# EAGLE schematic HE6-RORO101 (EAGLE 9.6.2)
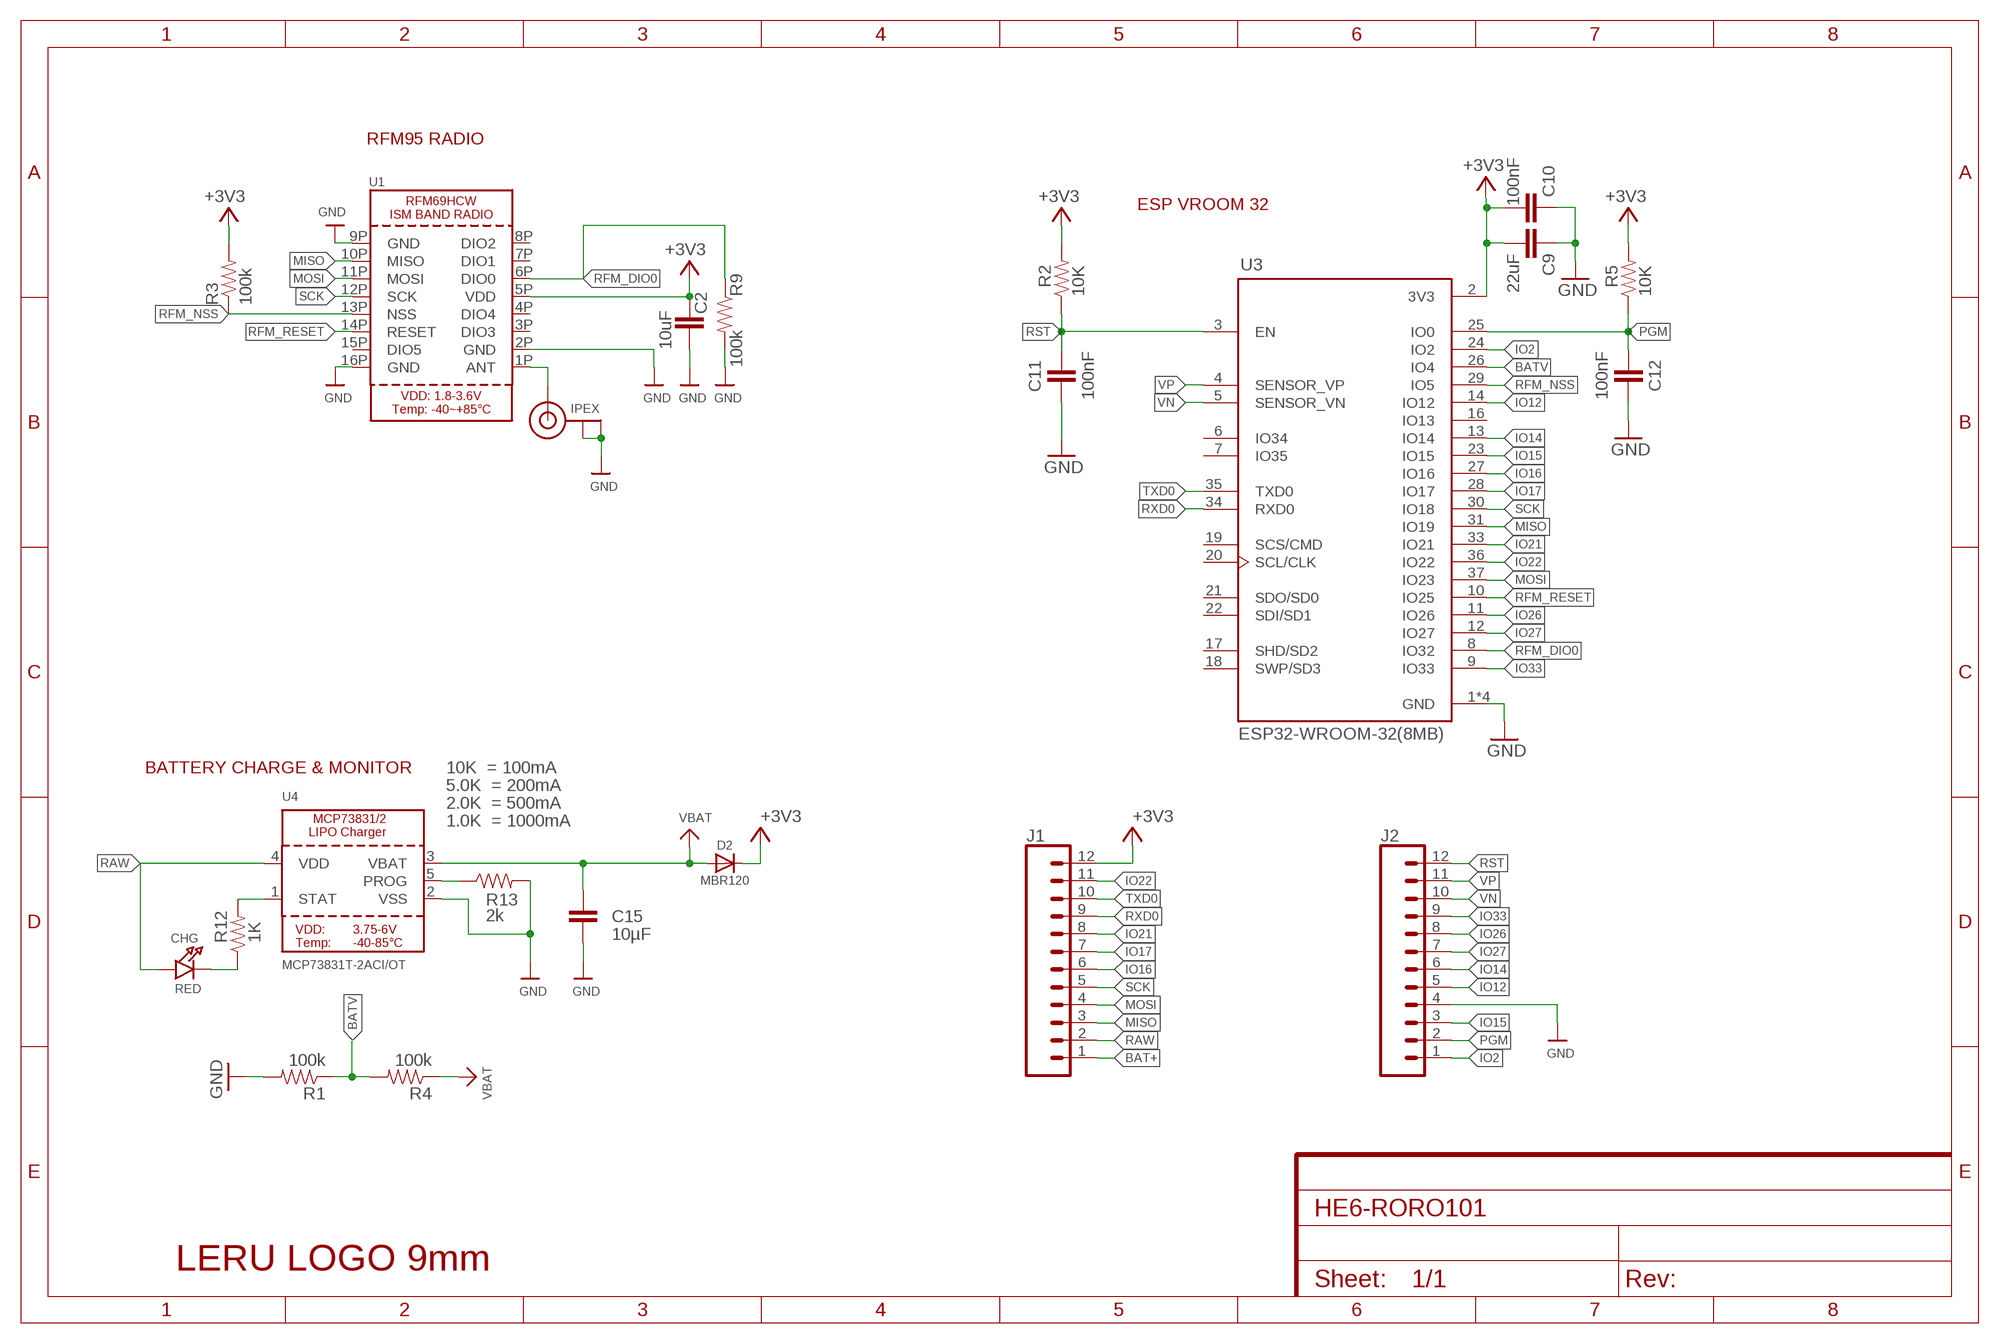
[diagram p0: schematic, sheet 1]

## Parts
C2  10uF  CAP0805  [CAP]
C9  22uF  CAP0805  [CAP]
C10  100nF  CAP0805  [CAP]
C11  100nF  CAP0805  [CAP]
C12  100nF  CAP0805  [CAP]
C15  10µF  CAP0805  [CAP]
CHG  RED  LED0805_NOOUTLINE  [CHIPLED_0805_NOOUTLINE]
D2  MBR120  DIODESOD123  [DIODE]
IPEX  MICROBUILDER_ANTENNA_U.FL  [MICROBUILDER_U.FL]
J1  CONN_12LONGPADS  [1X12_LONGPADS]
J2  CONN_12LONGPADS  [1X12_LONGPADS]
R1  100k  RES0805-RES  [RES]
R2  10K  RES0805-RES  [RES]
R3  100k  RES0805-RES  [RES]
R4  100k  RES0805-RES  [RES]
R5  10K  RES0805-RES  [RES]
R9  100k  RES0805-RES  [RES]
R12  1K  RES0805-RES  [RES]
R13  2k  RES0805-RES  [RES]
U1  RFM69HCW_SMT  [RFMHCW_SMT]
U3  ESP32-WROOM-32(8MB)  [MODULE_ESP32-WROOM-32(8MB)]
U4  MCP73831T-2ACI/OT  MCP73831/2  [SOT23-5]
U$9  LERU_LOGO_9MM  [LERU_LOGO_9MM]

## Nets
+3V3: C2.1 C9.2 C10.2 D2.1(C) J1.12 R2.2 R3.2 R5.2 U1.5P(VDD) U3.2(3V3)
BAT+: C15.1 D2.2(A) J1.1 R4.1 U4.3(VBAT) ; supply symbol labelled VBAT
BATV: R1.1 R4.2 U3.26(IO4)
GND: C2.2 C9.1 C10.1 C11.1 C12.1 C15.2 IPEX.1(GND) IPEX.2(GND) J2.4 R1.2 R9.2 R13.2 U1.2P(GND) U1.9P(GND) U1.16P(GND) U3.1(GND) U3.15(GND) U3.38(GND) U3.39(GND) U4.2(VSS)
IO2: J2.1 U3.24(IO2)
IO12: J2.5 U3.14(IO12)
IO14: J2.6 U3.13(IO14)
IO15: J2.3 U3.23(IO15)
IO16: J1.6 U3.27(IO16)
IO17: J1.7 U3.28(IO17)
IO21: J1.8 U3.33(IO21)
IO22: J1.11 U3.36(IO22)
IO26: J2.8 U3.11(IO26)
IO27: J2.7 U3.12(IO27)
IO33: J2.9 U3.9(IO33)
MISO: J1.3 U1.10P(MISO) U3.31(IO19)
MOSI: J1.4 U1.11P(MOSI) U3.37(IO23)
N$1: IPEX.3(SIGNAL) U1.1P(ANT)
N$12: CHG.C R12.1
N$13: R12.2 U4.1(STAT)
N$14: R13.1 U4.5(PROG)
PGM: C12.2 J2.2 R5.1 U3.25(IO0)
RAW [vcc]: CHG.A J1.2 U4.4(VDD)
RFM_DIO0: R9.1 U1.6P(DIO0) U3.8(IO32)
RFM_NSS: R3.1 U1.13P(NSS) U3.29(IO5)
RFM_RESET: U1.14P(RESET) U3.10(IO25)
RST: C11.2 J2.12 R2.1 U3.3(EN)
RXD0: J1.9 U3.34(RXD0)
SCK: J1.5 U1.12P(SCK) U3.30(IO18)
TXD0: J1.10 U3.35(TXD0)
VN: J2.10 U3.5(SENSOR_VN)
VP: J2.11 U3.4(SENSOR_VP)
Unconnected: U1.3P(DIO3) U1.4P(DIO4) U1.7P(DIO1) U1.8P(DIO2) U1.15P(DIO5) U3.6(IO34) U3.7(IO35) U3.16(IO13) U3.17(SHD/SD2) U3.18(SWP/SD3) U3.19(SCS/CMD) U3.20(SCL/CLK) U3.21(SDO/SD0) U3.22(SDI/SD1)

## Notes on the sheet
- RFM95 RADIO
- ESP VROOM 32
- BATTERY CHARGE & MONITOR | 10K  = 100mA
- 5.0K  = 200mA
- 2.0K  = 500mA
- 1.0K  = 1000mA

## Library data of the parts
C2 C9-C12 C15 = JLR:CAP: Capacitor Standard 0603 ceramic capacitor, and 0.1" leaded capacitor.
CHG = microbuilder:LED: LED 0603 - 0603 Surface Mount Package 2mA: Green LED - Low Power (3.9mcd, 2ma, 1.7Vf) - Digikey: 475-2709-2-ND Orange LED - Low Power (9.8mcd, 2ma, 1.8Vf) - Digikey: 475-1194-2-ND Red LED - Low Power (5mcd, 2ma, 1.8Vf) - Digikey: 475-1195-2-ND Yellow LED - Low Power (7mcd, 2ma, 1.8Vf) - Digikey: 475-1196-2-ND 5mA: Blue LED - Low Power (17mcd, 5ma, 2.9Vf) - Digikey: LNJ937W8CRACT-ND 0805 - 0805 Surface Mount Package 2mA: Red LED (8.8mcd, 2mA, 1.8Vf, Clear) - Low Power [Digikey: 475-2510-1-ND] Green LED (5mcd, 2mA, 1.8Vf, Clear) - Low Power [Digikey: 475-2730-1-ND] Yellow LED (11.3mcd, 2mA, 1.8Vf, Clear) - Low Power [Digikey: 475-2555-1-ND] 20mA: Red LED (104mcd, 20mA, Diffused) - LS R976 [Digikey: 475-1278-6-ND] Red LED (12mcd, 20mA, 2.0Vf, Clear) - APT2012EC [Digikey: 754-1128-1-ND] Green LED (15mcd, 20mA, 2.2Vf, Clear) - APT2012GC [Digikey: 754-1131-1-ND] Orange LED (160mcd, 20mA, 2.1Vf, Clear) - APT2012SECK [Digikey: 754-1130-1-ND] 1206 - 1206 Surface Mount Package Green LED (26mcd, 20mA, Diffused) - LG N971 [Digikey: 475-1407-6-ND] Red LED (15mcd, 20mA, Diffused) - LH N974 [Digikey: 475-1416-6-ND] Cree - Cree High-Power Surface Mount LEDs XPEBWT-L1-0000-00D50 - White 111lm 350mA 2.9Vf 6200K 110° XTEAWT-00-0000-00000LEE3 - White 114lm 350mA 2.85Vf 5000K 115° Everlight - Everlight 45-21 Series Surface Mount LEDs 45-21/QK2C-B2832AC2CB2/2T - Warm White 2000mcd 20mA 3.25Vf 3050K 120° 45-21/LK2C-B38452C4CB2/2T - Nuetral White 2000mcd 20mA 3.25Vf 4150K 120° 45-21/LK2C-B50634C6CB2/2T - Cold White 2200mcd 20mA 3.25Vf 5650K 120° PLCC2 Reverse Mount LS T77K-J1L2-1-0-2-R18-Z - Red 11.25mcd 2mA 1.8Vf 630nm 120° LO T77K-L1M2-24-Z - Orange 19.6mcd 2mA 1.8Vf 606nm 120° LY T77K-K2M1-26-Z - Yellow 15.7mcd 2mA 1.8Vf 587nm 120°
D2 = JLR:DIODE: DIODE unfilled
IPEX = A-3-7-1-2-80:MICROBUILDER_ANTENNA_U.FL: U.FL Antenna Connector
J1 J2 = SparkFun-Connectors:CONN_12: Multi connection point. Often used as Generic Header-pin footprint for 0.1 inch spaced/style header connections On any of the 0.1 inch spaced packages, you can populate with these: Break Away Headers - Straight <https://www.sparkfun.com/products/116> (PRT-00116) Break Away Male Headers - Right Angle <https://www.sparkfun.com/products/553> (PRT-00553) Female Headers <https://www.sparkfun.com/products/115> (PRT-00115) Break Away Headers - Machine Pin <https://www.sparkfun.com/products/117> (PRT-00117) Break Away Female Headers - Swiss Machine Pin <https://www.sparkfun.com/products/743> (PRT-00743) For SCREWTERMINALS and SPRING TERMINALS visit here: Screw Terimnals on SparkFun.com <https://www.sparkfun.com/search/results?term=Screw+Terminals> (5mm/3.5mm/2.54mm spacing) This device is also useful as a general connection point to wire up your design to another part of your project. Our various solder wires solder well into these plated through hole pads. Hook-Up Wire - Assortment (Stranded, 22 AWG) <https://www.sparkfun.com/products/11375> (PRT-11375) Hook-Up Wire - Assortment (Solid Core, 22 AWG) <https://www.sparkfun.com/products/11367> (PRT-11367) View the entire wire category on our website here <https://www.sparkfun.com/categories/141> Special notes: Molex polarized connector foot print use with SKU : PRT-08231 with associated crimp pins and housings. 1MM SMD Version SKU: PRT-10208 NOTES ON THE VARIANTS LOCK and LOCK_LONGPADS... This footprint was designed to help hold the alignment of a through-hole component (i.e. 6-pin header) while soldering it into place. You may notice that each hole has been shifted either up or down by 0.005 of an inch from it's more standard position (which is a perfectly straight line). This slight alteration caused the pins (the squares in the middle) to touch the edges of the holes. Because they are alternating, it causes a "brace" to hold the component in place. 0.005 has proven to be the perfect amount of "off-center" position when using our standard breakaway headers. Although looks a little odd when you look at the bare footprint, once you have a header in there, the alteration is very hard to notice. Also,if you push a header all the way into place, it is covered up entirely on the bottom side.
R1-R5 R9 R12 R13 = JLR:RES: Resistor Basic schematic elements and footprints for 0603, 1206, and PTH resistors.
U1 = microbuilder:RFM69HCW: RFM69HCW - ISM Band RF Transceiver
U3 = ESP32-WROOM-32_8MB_:ESP32-WROOM-32(8MB): WIFI MODULE 64 MBITS SPI FLASH; AVAILABILITY: Unavailable; DESCRIPTION: Bluetooth, WiFi 802.11b/g/n, Bluetooth v4.2 + EDR, Class 1, 2 and 3 Transceiver Module 2.4GHz ~ 2.5GHz Surface Mount; MF: Espressif Systems; MP: ESP32-WROOM-32 _8MB_; PACKAGE: Module Espressif Systems; PRICE: None
U4 = microbuilder:MCP73831/2: MCP73831/2 LIPO Charger VDD: 3.75 - 6V Temp -40 - 85°C Programmable Charge Rate: 15-500mA NOTE: STAT is a tri-state logic output on the MCP73831 and an open-drain output on the MCP73832. SOT23-5 with 4.2V output and tri-state logic on STAT = MCP73831T-2ACI/OT
U$9 = JLR:LERU_LOGO_9MM

## Net classes
1 vcc: width 0.254 mm